# Altium schematic sheet SD-Card.SchDoc: SD Card Slot
size A; DocumentNumber: 8; SheetNumber: 8; SheetTotal: 11
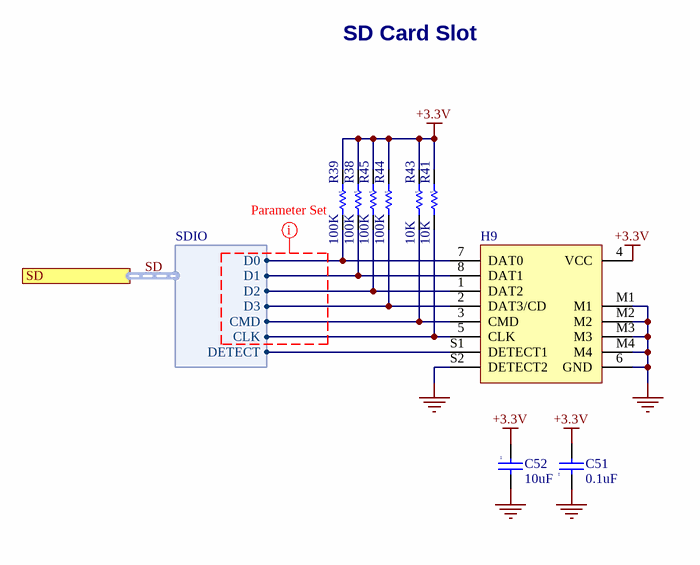
[diagram p0: SD-Card.SchDoc]

## Parts
C51  value 0.1uF  [0402]  (hidden comment: Cap)
C52  value 10uF  [0805]  (hidden comment: Cap)
H9  SD Card Socket  [114-00841-68]  (value not drawn)
R38  value 100K  [R0402]  (hidden comment: Res)
R39  value 100K  [R0402]  (hidden comment: Res)
R41  value 10K  [R0402]  (hidden comment: Res)
R43  value 10K  [R0402]  (hidden comment: Res)
R44  value 100K  [R0402]  (hidden comment: Res)
R45  value 100K  [R0402]  (hidden comment: Res)

## Ports
SD (harness SDIO)

## Harnesses
SDIO: CMD, CLK, D1, D0, D2, D3, DETECT

## Nets
+3.3V: C51.2 C52.1 H9.4(VCC) R38.1 R39.1 R41.1 R43.1 R44.1 R45.1
GND: C51.1 C52.2 H9.6(GND) H9.M1 H9.M2 H9.M3 H9.M4 H9.S2(DETECT2)
SD.CLK: H9.5(CLK) R41.2 ; port SD.CLK
SD.CMD: H9.3(CMD) R43.2 ; port SD.CMD
SD.D0: H9.7(DAT0) R39.2 ; port SD.D0
SD.D1: H9.8(DAT1) R38.2 ; port SD.D1
SD.D2: H9.1(DAT2) R45.2 ; port SD.D2
SD.D3: H9.2(DAT3/CD) R44.2 ; port SD.D3
SD.DETECT: H9.S1(DETECT1) ; port SD.DETECT

## Buses and harness runs
harness SD = port SD

## Layout directives
net class SD_BUS: (no net found under the mark)

## Notes on the sheet
- SD Card Slot
- Date
- Sheet
- Project
- Time
- PCB
- Assy
- of
- Size
- A
- File

## Library data of the parts
C51 = Cap: CAP CER .10UF 50V X7R 10% 0402; Manufacturer: TDK Corporation; Manufacturer Part Number: C1005X7R1H104K; Capacitance: 0.1µF; Published: 8-Jun-2000; LatestRevisionDate: 17-Jul-2002; LatestRevisionNote: Re-released for DXP Platform.; Publisher: Altium Limited; Category: Capacitors; Supplier 1: Digi-Key; Supplier Part Number 1: 445-5932-1-ND; RoHS: RoHS Compliant; Stock 1: 174080; Pricing 1: 1=0.3, 10=0.2, 100=0.08, 250=0.05752, 500=0.041, 1000=0.03 (USD); Voltage - Rated: 50V; Tolerance: ±10%; Temperature Coefficient: X7R; Mounting Type: Surface Mount, MLCC; Operating Temperature: -55°C ~ 125°C; Applications: General Purpose; Ratings: -; Package / Case: 0402 (1005 Metric); Size / Dimension: 0.039" L x 0.020" W (1.00mm x 0.50mm); Height: -; Thickness: 0.022" (0.55mm); Lead Spacing: -; Features: -; Packaging: Cut Tape (CT); Lead Style: -; ComponentLink1URL: http://www.tdk.co.jp/tefe02/e412_c.pdf; ComponentLink1Description: http://www.tdk.co.jp/tefe02/e412_c.pdf
C52 = Cap: CAP CER 10UF 35V X5R 0805; Manufacturer: TDK; Manufacturer Part Number: C2012X5R1V106K085AC; Dielectric Material: Ceramic; Tolerance: 10%; Published: 8-Jun-2000; LatestRevisionDate: 17-Jul-2002; LatestRevisionNote: Re-released for DXP Platform.; Publisher: Altium Limited; Category: Capacitors; Supplier 1: Digi-Key; Supplier Part Number 1: 445-14417-6-ND; Stock 1: 0; Pricing 1: 1=0.83, 10=0.589, 100=0.3881, 500=0.2875, 1000=0.24438 (USD); Mount: Surface Mount; Case/Package: 0805; Weight: 0.000194oz; Case Code (Metric): 2012; Case Code (Imperial): 0805; Min Operating Temperature: -55°C; Max Operating Temperature: 85°C; Package Quantity: 1; Packaging: Tape and Reel; Capacitance: 10uF; Voltage Rating: 35V; Termination: SMD/SMT; Voltage Rating (DC): 35V; Dielectric: X5R; Length: 0.079inch; Height: 0.85mm; Width: 0.049inch; Thickness: 0.039inch; Lead Free: Lead Free; REACH SVHC: No SVHC; ComponentLink1URL: https://datasheet.ciiva.com/14894/tdkmlcccaprange-14894527.pdf; ComponentLink1Description: https://datasheet.ciiva.com/14894/tdkmlcccaprange-14894527.pdf
H9 = SD Card Socket: CONN MICRO SD CARD PUSH-PULL R/A; Manufacturer: Amphenol Commercial; Connector Type: Connector; Number of Contacts: 8; Gender: Receptacle; Pitch: 1.1mm; ComponentLink1URL: https://datasheet.ciiva.com/683/114-00841-68-683584.pdf; ComponentLink1Description: https://datasheet.ciiva.com/683/114-00841-68-683584.pdf; ComponentLink2URL: https://datasheet.ciiva.com/24241/11400841-283410-24241569.pdf; ComponentLink2Description: https://datasheet.ciiva.com/24241/11400841-283410-24241569.pdf; ComponentLink3URL: https://datasheet.ciiva.com/28408/11400841-28408193.pdf; ComponentLink3Description: https://datasheet.ciiva.com/28408/11400841-28408193.pdf; ComponentLink4URL: https://datasheet.ciiva.com/9464/1140084168-9464901.pdf; ComponentLink4Description: https://datasheet.ciiva.com/9464/1140084168-9464901.pdf; ComponentLink5URL: https://datasheet.ciiva.com/48965/70323450-48965706.pdf; ComponentLink5Description: https://datasheet.ciiva.com/48965/70323450-48965706.pdf; ComponentLink6URL: https://datasheet.ciiva.com/16655/1140084168-16655293.pdf; ComponentLink6Description: https://datasheet.ciiva.com/16655/1140084168-16655293.pdf; Supplier 1: Digi-Key; Supplier Part Number 1: 114-00841-68-6-ND; Manufacturer Part Number: 114-00841-68; Stock 1: 42391; Pricing 1: 1=1.31, 10=1.188, 25=1.1156, 50=1.0672, 100=1.0187, 250=0.92168, 500=0.84892 (USD); Mount: Surface Mount; Contact Material: Copper,Copper Alloy; Contact Plating: Gold; Housing Material: Polymer; Package Quantity: 1; Packaging: Tape and Reel; Number of Rows: 1; Termination: SMD/SMT; Orientation: Right Angle; Length: 15.6mm; Height: 1.55mm; Depth: 11.45mm; Radiation Hardening: No; REACH SVHC: Unknown; Lead Free: Lead Free; Flammability Rating: UL94 V-0
R38 R39 R44 R45 = Res: RES SMD 100K OHM 1% 1/16W 0402; Manufacturer: Panasonic; Manufacturer Part Number: ERJ-2RKF1003X; Resistance: 100kR; Temperature Coefficient: 100ppm/°C; Power Rating: 100mW; Voltage Rating: 50V; ComponentLink1URL: http://www.seielect.com/Catalog/SEI-RMCF_RMCP.pdf; ComponentLink1Description: http://www.seielect.com/Catalog/SEI-RMCF_RMCP.pdf; Supplier 1: Digi-Key; Supplier Part Number 1: P100KLDKR-ND; Stock 1: 6572; Pricing 1: 1=0.1, 10=0.045, 100=0.0184, 1000=0.00826, 2500=0.00717, 5000=0.00593 (USD); Mount: Surface Mount; Case/Package: 0402; Number of Pins: 2; Contact Plating: Tin; Case Code (Imperial): 0402; Case Code (Metric): 1005; Min Operating Temperature: -55°C; Max Operating Temperature: 155°C; Tolerance: 1%; Composition: Thick Film; Packaging: Tape and Reel; Package Quantity: 1; Termination: SMD/SMT; Number of Terminations: 2; Military Standard: Not; Max Power Dissipation: 100mW; Voltage Rating (DC): 50V; Features: Automotive AEC-Q200; Length: 1mm; Height: 0.35mm; Width: 0.5mm; Depth: 0.5mm; Radiation Hardening: No; REACH SVHC: No SVHC; Lead Free: Lead Free
R41 R43 = Res: RES 10K OHM 1/16W 1% 0402 SMD; Manufacturer: Panasonic; Manufacturer Part Number: ERJ-2RKF1002X; Resistance: 10kR; Temperature Coefficient: 100ppm/°C; Power Rating: 100mW; Voltage Rating: 50V; ComponentLink1URL: http://industrial.panasonic.com/www-cgi/jvcr13pz.cgi?E+PZ+3+AOA0002+ERJ2RKF1002X+7+WW; ComponentLink1Description: http://industrial.panasonic.com/www-cgi/jvcr13pz.cgi?E+PZ+3+AOA0002+ERJ2RKF1002X+7+WW; Supplier 1: Digi-Key; Supplier Part Number 1: P10.0KLDKR-ND; Stock 1: 28312782; Pricing 1: 1=0.1, 10=0.045, 100=0.0184, 1000=0.00826, 2500=0.00717, 5000=0.00593 (USD); Mount: Surface Mount; Case/Package: 0402; Number of Pins: 2; Contact Plating: Tin; Case Code (Metric): 1005; Case Code (Imperial): 0402; Min Operating Temperature: -55°C; Max Operating Temperature: 155°C; Tolerance: 1%; Composition: Thick Film; Packaging: Tape and Reel; Package Quantity: 1; Number of Terminations: 2; Termination: SMD/SMT; Military Standard: Not; Max Power Dissipation: 100mW; Voltage Rating (DC): 50V; Features: Automotive AEC-Q200; Length: 1mm; Height: 0.35mm; Width: 0.02inch; Depth: 0.5mm; Radiation Hardening: No; REACH SVHC: No SVHC; Lead Free: Lead Free